# Altium project Controller-RK3562.PrjPcb (part 8 of 8)

## Sheet WF-BT-AP6256.SchDoc
size 420 x 289 mm; SheetNumber: 31; SheetTotal: 32
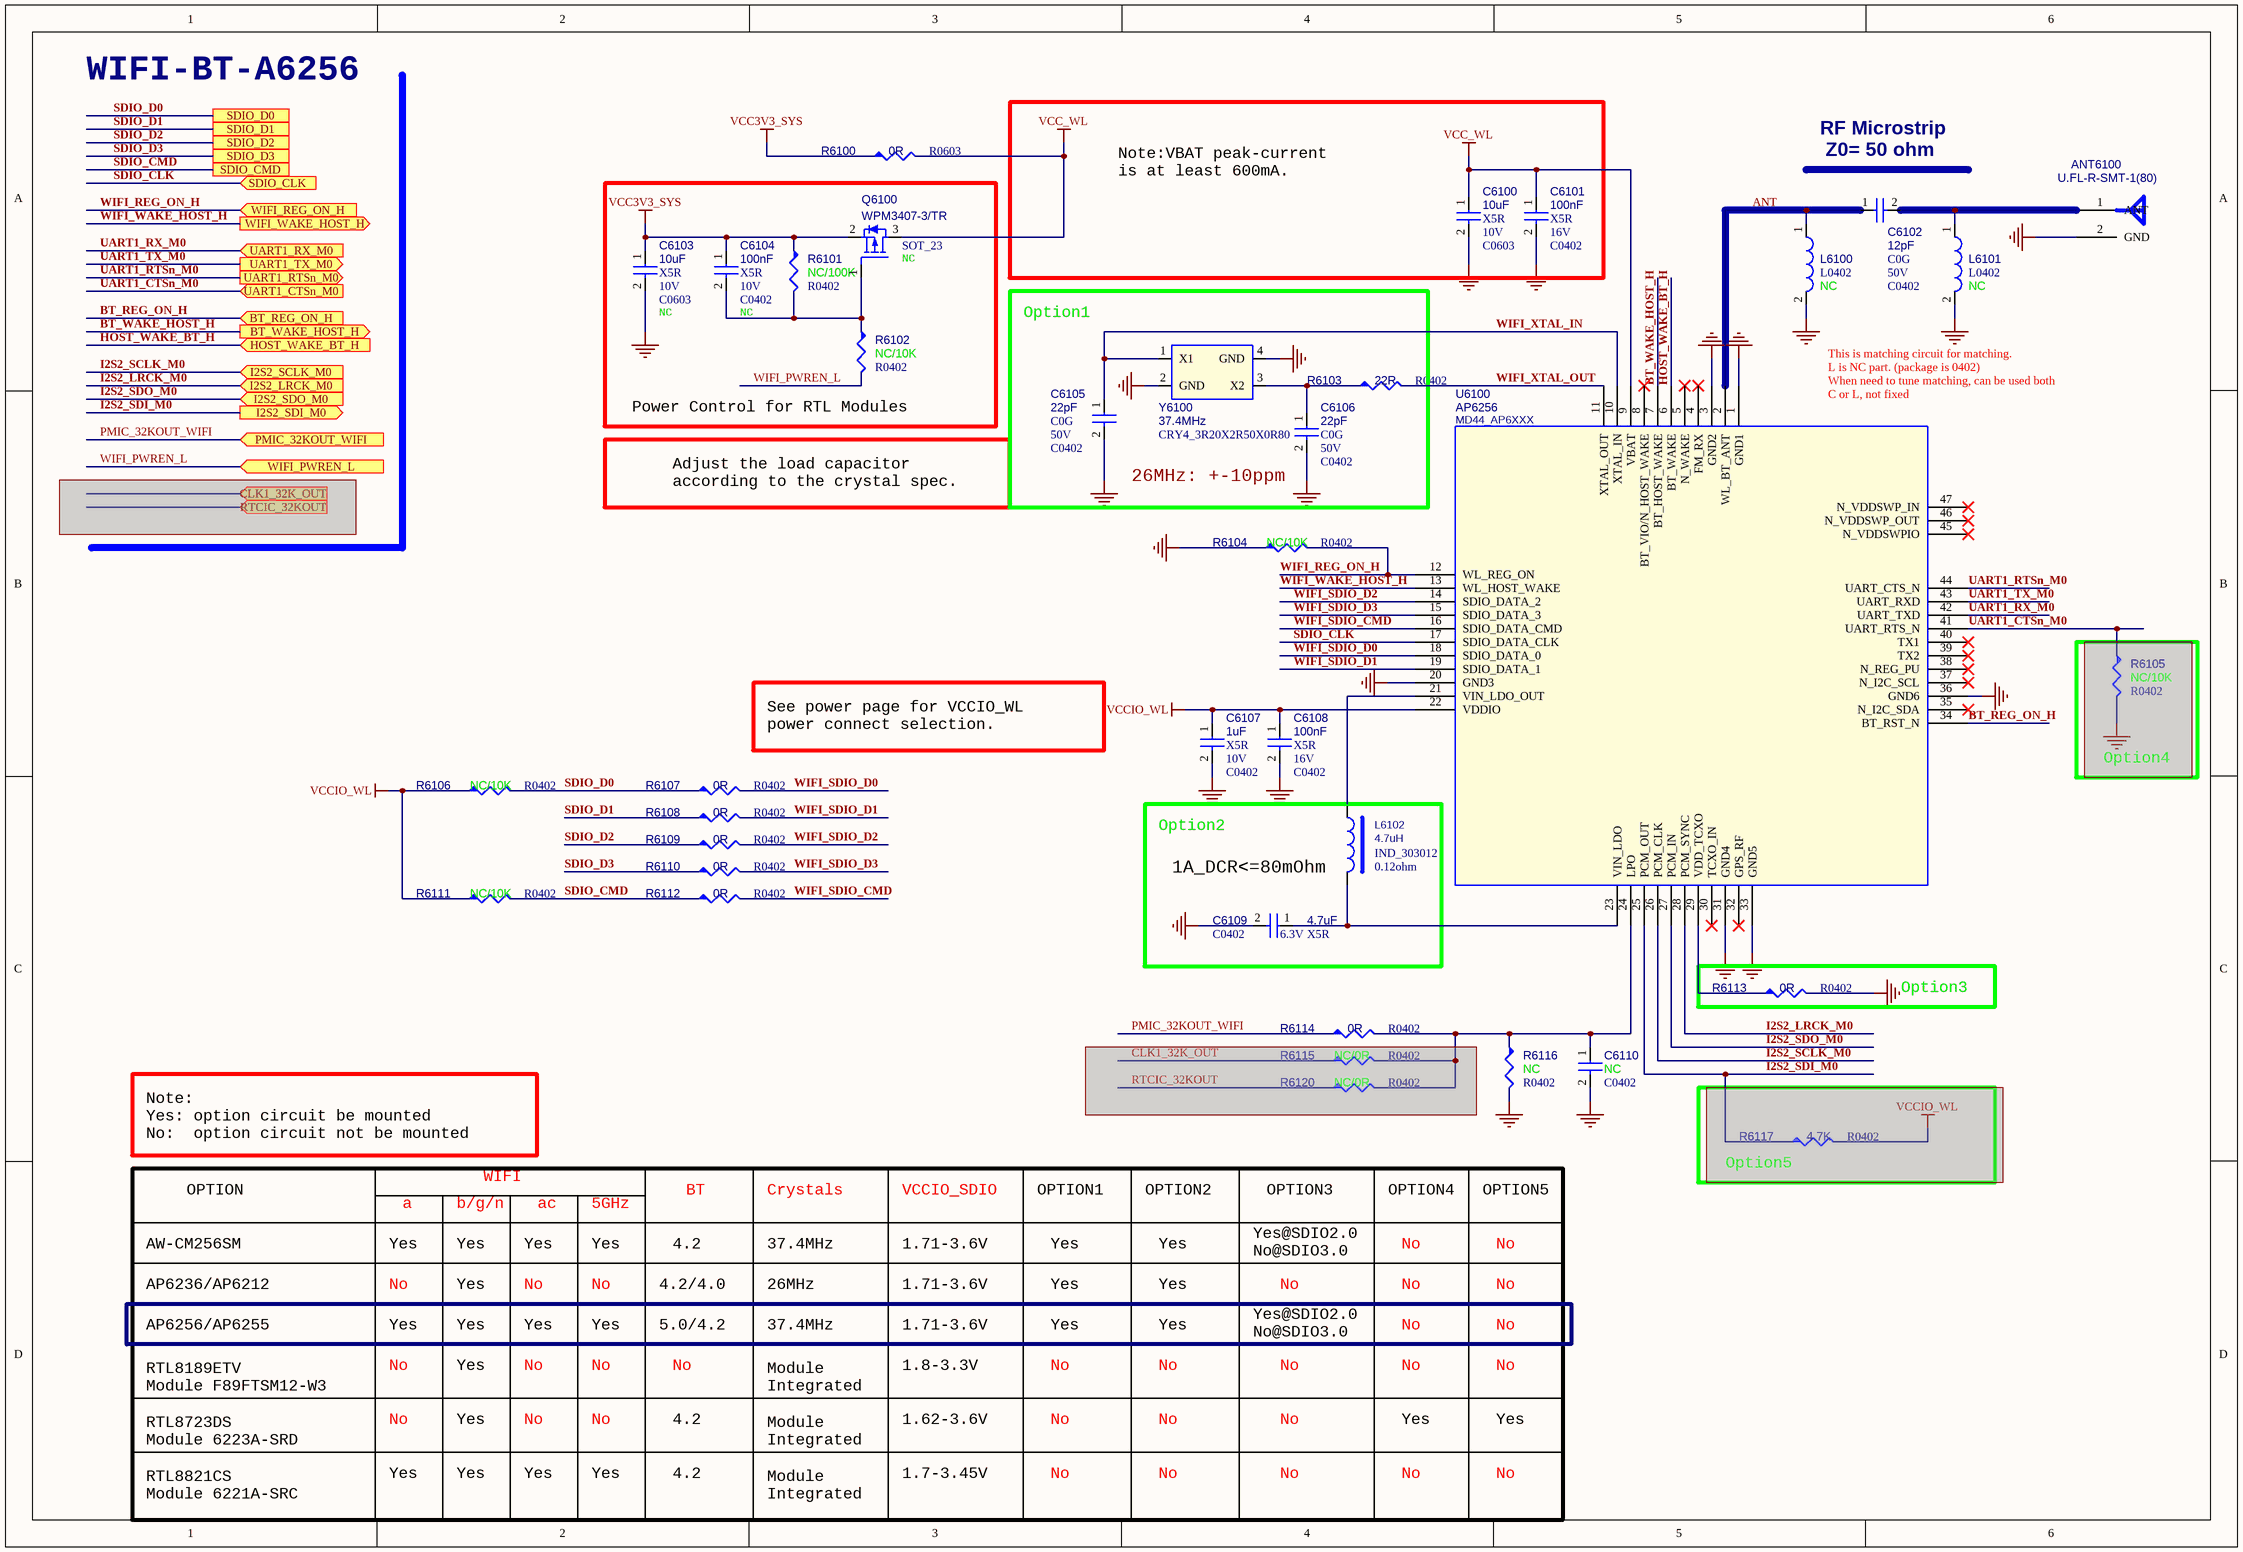
[diagram p36: WF-BT-AP6256.SchDoc]

### Parts
ANT6100  U.FL-R-SMT-1(80)  [IPEX-SMD_BWIPX-1-001E]
C6100  10uF  Dielectric: X5R  Voltage: 10V  [C0603]
C6101  100nF  Dielectric: X5R  Voltage: 16V  [C0402]
C6102  12pF  Dielectric: C0G  Voltage: 50V  [C0402]
C6103  10uF  Dielectric: X5R  Voltage: 10V  option: NC  [C0603]
C6104  100nF  Dielectric: X5R  Voltage: 10V  option: NC  [C0402]
C6105  22pF  Dielectric: C0G  Voltage: 50V  [C0402]
C6106  22pF  Dielectric: C0G  Voltage: 50V  [C0402]
C6107  1uF  Dielectric: X5R  Voltage: 10V  [C0402]
C6108  100nF  Dielectric: X5R  Voltage: 16V  [C0402]
C6109  4.7uF  Dielectric: X5R  Voltage: 6.3V  [C0402]
C6110  NC  [C0402]
L6100  NC  [L0402]
L6101  NC  [L0402]
L6102  4.7uH  PCB Footprint: IND_303012  DC Resistor: 0.12ohm  [IND_303015]
Q6100  WPM3407-3/TR  PCB Footprint: SOT_23  option: NC  [SOT23-3D]
R6100  0R  PCB Footprint: R0603  [R0402]
R6101  NC/100K  [R0402]
R6102  NC/10K  [R0402]
R6103  22R  [R0402]
R6104  NC/10K  [R0402]
R6105  NC/10K  [R0402]  (masked out: inside a compile mask, not in the netlist)
R6106  NC/10K  [R0402]
R6107  0R  [R0402]
R6108  0R  [R0402]
R6109  0R  [R0402]
R6110  0R  [R0402]
R6111  NC/10K  [R0402]
R6112  0R  [R0402]
R6113  0R  [R0402]
R6114  0R  [R0402]
R6115  NC/0R  [R0402]  (masked out: inside a compile mask, not in the netlist)
R6116  NC  [R0402]
R6117  4.7K  [R0402]  (masked out: inside a compile mask, not in the netlist)
R6120  NC/0R  [R0402]  (masked out: inside a compile mask, not in the netlist)
U6100  AP6256  PCB Footprint: MD44_AP6XXX  [QFN-44_L12.0-W12.0-P0.90-TL_AP6256]
Y6100  37.4MHz  [CRY4_3R20X2R50X0R80]

### Blocks framed on the sheet
Power Control for RTL Modules: C6103 C6104 Q6100 R6101 R6102
26MHz: +-10ppm: C6105 C6106 R6103 Y6100
Option4: R6105
1A_DCR<=80mOhm: C6109 L6102
Option3: R6113
Option5: R6117

### Ports
BT_REG_ON_H (in, see Controller-RK3562-TOP[7D], CONTROLLER-RK3562[7A], RK3562-PMUIO-OSC-PLL[5C]), BT_WAKE_HOST_H (out, see Controller-RK3562-TOP[7D], CONTROLLER-RK3562[7A], RK3562-PMUIO-OSC-PLL[5C]), CLK1_32K_OUT (in, see Controller-RK3562-TOP[7D], CONTROLLER-RK3562[7A]), HOST_WAKE_BT_H (in, see Controller-RK3562-TOP[7D], CONTROLLER-RK3562[7A], RK3562-PMUIO-OSC-PLL[5C]), I2S2_LRCK_M0 (in, see Controller-RK3562-TOP[7D], CONTROLLER-RK3562[3B], RK3562-VCCIO4[4B]), I2S2_SCLK_M0 (in, see Controller-RK3562-TOP[7D], CONTROLLER-RK3562[3B], RK3562-VCCIO4[4B]), I2S2_SDI_M0 (out, see Controller-RK3562-TOP[7D], CONTROLLER-RK3562[3B], RK3562-VCCIO4[4B]), I2S2_SDO_M0 (in, see Controller-RK3562-TOP[7D], CONTROLLER-RK3562[3B], RK3562-VCCIO4[4B]), PMIC_32KOUT_WIFI (in, see Controller-RK3562-TOP[7D], CONTROLLER-RK3562[1B], RK-POWER-SUPPLY[1A]), RTCIC_32KOUT (in, see Controller-RK3562-TOP[7D], CONTROLLER-RK3562[7A]), SDIO_CLK (in, see Controller-RK3562-TOP[7D], CONTROLLER-RK3562[3B], RK3562-VCCIO4[4A]), SDIO_CMD (see Controller-RK3562-TOP[7D], CONTROLLER-RK3562[3B], RK3562-VCCIO4[4A]), SDIO_D0 (see Controller-RK3562-TOP[7D], CONTROLLER-RK3562[3B], RK3562-VCCIO4[4A]), SDIO_D1 (see Controller-RK3562-TOP[7D], CONTROLLER-RK3562[3B], RK3562-VCCIO4[4A]), SDIO_D2 (see Controller-RK3562-TOP[7D], CONTROLLER-RK3562[3B], RK3562-VCCIO4[4A]), SDIO_D3 (see Controller-RK3562-TOP[7D], CONTROLLER-RK3562[3B], RK3562-VCCIO4[4A]), UART1_CTSn_M0 (in, see Controller-RK3562-TOP[7D], CONTROLLER-RK3562[3B], RK3562-VCCIO4[4B]), UART1_RTSn_M0 (out, see Controller-RK3562-TOP[7D], CONTROLLER-RK3562[3B], RK3562-VCCIO4[4B]), UART1_RX_M0 (in, see Controller-RK3562-TOP[7D], CONTROLLER-RK3562[3B]), UART1_TX_M0 (out, see Controller-RK3562-TOP[7D], CONTROLLER-RK3562[3B]), WIFI_PWREN_L (in, see Controller-RK3562-TOP[7D], CONTROLLER-RK3562[7A]), WIFI_REG_ON_H (in, see Controller-RK3562-TOP[7D], CONTROLLER-RK3562[7A], RK3562-PMUIO-OSC-PLL[5C]), WIFI_WAKE_HOST_H (out, see Controller-RK3562-TOP[7D], CONTROLLER-RK3562[7A], RK3562-PMUIO-OSC-PLL[5C])

### Nets
GND: ANT6100.2(GND) C6100.2 C6101.2 C6103.2 C6105.2 C6106.2 C6107.2 C6108.2 C6109.2 C6110.2 L6100.2 L6101.2 R6104.1 R6113.2 R6116.2 U6100.1(GND1) U6100.3(GND2) U6100.20(GND3) U6100.31(GND4) U6100.33(GND5) U6100.36(GND6) Y6100.2(GND) Y6100.4(GND)
VCC3V3_SYS: C6103.1 C6104.1 Q6100.2(SOURCE) R6100.1 R6101.1
VCC_WL: C6100.1 C6101.1 Q6100.3(DRAIN) R6100.2 U6100.9(VBAT)
VCCIO_WL: C6107.1 C6108.1 R6106.1 R6111.1 U6100.22(VDDIO)
ANT: C6102.1 L6100.1 U6100.2(WL_BT_ANT)
BT_REG_ON_H: U6100.34(BT_RST_N) ; port BT_REG_ON_H
BT_WAKE_HOST_H: U6100.7(BT_HOST_WAKE) ; port BT_WAKE_HOST_H
HOST_WAKE_BT_H: U6100.6(BT_WAKE) ; port HOST_WAKE_BT_H
I2S2_LRCK_M0: U6100.28(PCM_SYNC) ; port I2S2_LRCK_M0
I2S2_SCLK_M0: U6100.26(PCM_CLK) ; port I2S2_SCLK_M0
I2S2_SDI_M0: U6100.25(PCM_OUT) ; port I2S2_SDI_M0
I2S2_SDO_M0: U6100.27(PCM_IN) ; port I2S2_SDO_M0
PMIC_32KOUT_WIFI: R6114.1 ; port PMIC_32KOUT_WIFI
SDIO_CLK: U6100.17(SDIO_DATA_CLK) ; port SDIO_CLK
SDIO_CMD: R6111.2 R6112.1 ; port SDIO_CMD
SDIO_D0: R6106.2 R6107.1 ; port SDIO_D0
SDIO_D1: R6108.1 ; port SDIO_D1
SDIO_D2: R6109.1 ; port SDIO_D2
SDIO_D3: R6110.1 ; port SDIO_D3
UART1_CTSn_M0: U6100.41(UART_RTS_N) ; port UART1_CTSn_M0
UART1_RTSn_M0: U6100.44(UART_CTS_N) ; port UART1_RTSn_M0
UART1_RX_M0: U6100.42(UART_TXD) ; port UART1_RX_M0
UART1_TX_M0: U6100.43(UART_RXD) ; port UART1_TX_M0
WIFI_PWREN_L: R6102.2 ; port WIFI_PWREN_L
WIFI_REG_ON_H: R6104.2 U6100.12(WL_REG_ON) ; port WIFI_REG_ON_H
WIFI_SDIO_CMD: R6112.2 U6100.16(SDIO_DATA_CMD)
WIFI_SDIO_D0: R6107.2 U6100.18(SDIO_DATA_0)
WIFI_SDIO_D1: R6108.2 U6100.19(SDIO_DATA_1)
WIFI_SDIO_D2: R6109.2 U6100.14(SDIO_DATA_2)
WIFI_SDIO_D3: R6110.2 U6100.15(SDIO_DATA_3)
WIFI_WAKE_HOST_H: U6100.13(WL_HOST_WAKE) ; port WIFI_WAKE_HOST_H
WIFI_XTAL_IN: C6105.1 U6100.10(XTAL_IN) Y6100.1(X1)
WIFI_XTAL_OUT: R6103.2 U6100.11(XTAL_OUT)
NetANT6100_1: ANT6100.1(ANT) C6102.2 L6101.1
NetC6104_2: C6104.2 Q6100.1(GATE) R6101.2 R6102.1
NetC6106_1: C6106.1 R6103.1 Y6100.3(X2)
NetC6109_1: C6109.1 L6102.2 U6100.23(VIN_LDO)
NetC6110_1: C6110.1 R6114.2 R6116.1 U6100.24(LPO)
NetL6102_1: L6102.1 U6100.21(VIN_LDO_OUT)
NetR6113_1: R6113.1 U6100.29(VDD_TCXO)

Not connected (* = marked no-connect by the designer): U6100 4(FM_RX)* 5(N_WAKE)* 8(BT_VIO/N_HOST_WAKE)* 30(TCXO_IN)* 32(GPS_RF)* 35(N_I2C_SDA)* 37(N_I2C_SCL)* 38(N_REG_PU)* 39(TX2)* 40(TX1)* 45(N_VDDSWPIO)* 46(N_VDDSWP_OUT)* 47(N_VDDSWP_IN)*

### Notes on the sheet
- WIFI-BT-A6256
- RF Microstrip
  Z0= 50 ohm
- Note:VBAT peak-current
  is at least 600mA.
- Option1
- (near U6100) This is matching circuit for matching.
  L is NC part. (package is 0402)
  When need to tune matching, can be used both C or L, not fixed
- Adjust the load capacitor
  according to the crystal spec.
- See power page for VCCIO_WL
  power connect selection.
- Option2
- Note:
  Yes: option circuit be mounted
  No:  option circuit not be mounted
- OPTION
- a
- b/g/n
- WIFI
- ac
- 5GHz
- BT
- Crystals
- VCCIO_SDIO
- OPTION1
- OPTION2
- OPTION3
- OPTION4
- OPTION5
- AW-CM256SM
- AP6236/AP6212
- Yes
- No
- 4.2/4.0
- 4.2
- 37.4MHz
- 26MHz
- 1.71-3.6V
- Yes@SDIO2.0
  No@SDIO3.0
- AP6256/AP6255
- 5.0/4.2
- 1.8-3.3V
- RTL8189ETV
  Module F89FTSM12-W3
- Module
  Integrated
- 1.62-3.6V
- RTL8723DS
  Module 6223A-SRD
- RTL8821CS
  Module 6221A-SRC
- 1.7-3.45V

### Library data of the parts
ANT6100 = ANT_1P1G: BWIPX-1-001E; Manufacturer: Rockchip
C6100 = CAP NP: cap,10.00uF,+/-10%,10V,X5R,C0603; Part Reference: C6100; Manufacturer PN: C1608X5R1A106K080AC; Manufacturer: TDK; Tolerance: 10%; Priority: A; PCB Footprint: C0603; Value: 10uF; Created by: JJJ; Part Type: C0603; RK PN: C1608X5R1A106K080AC
C6101 = CAP NP: cap,100.00nF,+/-10%,16V,X5R,C0402; Part Reference: C6101; Manufacturer PN: C1005X5R1C104K050BA; Manufacturer: TDK; C_Voltage: 10V; Tolerance: 10%; Priority: A; Number: 37; PCB Footprint: C0402; Value: 100nF; Created by: JJJ; Part Type: C0402; RK PN: C1005X5R1C104K050BA
C6102 = CAP NP: cap,10.00pF,+/-0.5,50V,C0G,C0402; Part Reference: C6102; Manufacturer: TDK; Priority: A; Tolerance: +/-0.5pF; PCB Footprint: C0402; Value: 12pF; Part Type: C0402; Created by: JJJ
C6103 = CAP NP: cap,10.00uF,+/-10%,10V,X5R,C0603; Part Reference: C6103; Manufacturer PN: C1608X5R1A106K080AC; Manufacturer: TDK; Tolerance: 10%; C_Voltage: 6.3V; Priority: A; PCB Footprint: C0603; Value: 10uF; Created by: JJJ; Part Type: C0603; RK PN: C1608X5R1A106K080AC
C6104 = CAP NP: cap,100.00nF,+/-10%,10V,X5R,C0402; Part Reference: C6104; Manufacturer: TDK; Number: 37; RK PN: C1005X5R1A104K050BA; Priority: A; Tolerance: 10%; C_Voltage: 6.3V; PCB Footprint: C0402; Value: 100nF; Part Type: C0402; Manufacturer PN: C1005X5R1A104K050BA; Created by: JJJ
C6105 = CAP NP: cap,22.00pF,+/-5%,50V,C0G,C0402; Part Reference: C6105; Manufacturer: TDK; RK PN: C1005C0G1H220J050BA; Priority: A; Tolerance: 5%; PCB Footprint: C0402; Value: 22pF; Part Type: C0402; Manufacturer PN: C1005C0G1H220J050BA; Created by: JJJ
C6106 = CAP NP: cap,22.00pF,+/-5%,50V,C0G,C0402; Part Reference: C6106; Manufacturer: TDK; RK PN: C1005C0G1H220J050BA; Priority: A; Tolerance: 5%; PCB Footprint: C0402; Value: 22pF; Part Type: C0402; Manufacturer PN: C1005C0G1H220J050BA; Created by: JJJ
C6107 = CAP NP: cap,1.00uF,+/-10%,10V,X5R,C0402; Part Reference: C6107; Manufacturer PN: C1005X5R1A105K050BB; Manufacturer: TDK; Tolerance: 10%; Priority: A; PCB Footprint: C0402; Value: 1uF; Created by: JJJ; Part Type: C0402; RK PN: C1005X5R1A105K050BB
C6108 = CAP NP: cap,100.00nF,+/-10%,16V,X5R,C0402; Part Reference: C6108; Manufacturer: TDK; Number: 37; RK PN: C1005X5R1C104K050BA; Priority: A; Tolerance: 10%; C_Voltage: 10V; PCB Footprint: C0402; Value: 100nF; Part Type: C0402; Manufacturer PN: C1005X5R1C104K050BA; Created by: JJJ
C6109 = CAP NP: cap,4.70uF,+/-10%,6.3V,X5R,C0402; Part Reference: C6109; Manufacturer: TDK; RK PN: C1005X5R0J475K050BC; Priority: A; Tolerance: 10%; PCB Footprint: C0402; Value: 4.7uF; Part Type: C0402; Manufacturer PN: C1005X5R0J475K050BC; Created by: JJJ
C6110 = CAP NP_NC: NC电容，无容值.; Part Reference: C6110; Optional: X; Priority: A; RK PN: 902012106-1; PCB Footprint: C0402; Value: NC; Created by: JJJ; Part Type: NC电容
L6100 = INDUCTOR: Did Not Place.; Part Reference: L6100; RK PN: DNPL0402; Priority: A; PCB Footprint: L0402; Value: NC; Part Type: IND; Created by: JJJ
L6101 = INDUCTOR: Did Not Place.; Part Reference: L6101; Priority: A; RK PN: DNPL0402; PCB Footprint: L0402; Value: NC; Created by: JJJ; Part Type: IND
L6102 = INDUCTORS OF FERRITE: Power Inductor,4.7uH,0.2,IND_303012; Part Reference: L6102; Manufacturer: sunlord; Isat: 0.90A; RK PN: SWPA3012S4R7MT; Priority: A; Tolerance: 20%; Irms: 1.24A; Resonace frequency: 61M; Value: 4.7uH; Part Type: POWER_IND; Manufacturer PN: SWPA3012S4R7MT; Created by: YTL
Q6100 = MOSFET P_Dup1: PMOS,WPM3407-3/TR,SOT_23,Id=4.4A,Vds=30V; Part Reference: Q6100; Manufacturer: WillSemi(韦尔半导体); Pd: 0.9W; Vgsth: 2.0V; VDS: 30V; Vgs: ±20V; Id_max: 4.4A; Priority: A; Value: WPM3407-3/TR; Created by: JJJ; Manufacturer PN: WPM3407-3/TR; Part Type: PMOS; RK PN: WPM3407-3/TR
R6100 = RESISTOR5: 通用厚膜电阻,0R,+/-5%,R0603,1/10W.; Part Reference: R6100; Manufacturer: YAGEO; Manufacturer PN: RC0603JR-070RL; Tolerance: 5%; RK PN: 901002435; Priority: A; Wattage: 1/10W; Value: 0R; Part Type: 通用厚膜电阻; Created by: YTL
R6101 = RESISTOR5_NC: 通用厚膜电阻,100K,+/-5%,R0402,1/16W.; Part Reference: R6101; Manufacturer: YAGEO; Manufacturer PN: RC0402JR-07100KL; Tolerance: 5%; RK PN: 901001447-1; Priority: A; Wattage: 1/16W; Optional: X; PCB Footprint: R0402; Value: NC/100K; Part Type: 通用厚膜电阻; Created by: YTL
R6102 = RESISTOR5_NC: 通用厚膜电阻,10K,+/-5%,R0402,1/16W.; Part Reference: R6102; Manufacturer PN: RC0402JR-0710KL; Manufacturer: YAGEO; Tolerance: 5%; Optional: X; Wattage: 1/16W; Priority: A; RK PN: 901001449-1; PCB Footprint: R0402; Value: NC/10K; Created by: YTL; Part Type: 通用厚膜电阻
R6103 = RESISTOR5: 通用厚膜电阻,22R,+/-5%,R0402,1/16W.; Part Reference: R6103; Manufacturer: YAGEO; Manufacturer PN: RC0402JR-0722RL; Tolerance: 5%; RK PN: 901001505; Priority: A; Wattage: 1/16W; PCB Footprint: R0402; Value: 22R; Part Type: 通用厚膜电阻; Created by: YTL
R6104 = RESISTOR5_NC: 通用厚膜电阻,10K,+/-5%,R0402,1/16W.; Part Reference: R6104; Manufacturer: YAGEO; Manufacturer PN: RC0402JR-0710KL; Tolerance: 5%; RK PN: 901001449-1; Priority: A; Wattage: 1/16W; Optional: X; PCB Footprint: R0402; Value: NC/10K; Part Type: 通用厚膜电阻; Created by: YTL
R6105 = RESISTOR5_NC: 通用厚膜电阻,10K,+/-5%,R0402,1/16W.; Part Reference: R6105; Manufacturer PN: RC0402JR-0710KL; Manufacturer: YAGEO; Tolerance: 5%; Optional: X; Wattage: 1/16W; Priority: A; RK PN: 901001449-1; PCB Footprint: R0402; Value: NC/10K; Created by: YTL; Part Type: 通用厚膜电阻
R6106 = RESISTOR5_NC: 通用厚膜电阻,10K,+/-5%,R0402,1/16W.; Part Reference: R6106; Manufacturer: YAGEO; Manufacturer PN: RC0402JR-0710KL; Tolerance: 5%; RK PN: 901001449-1; Priority: A; Wattage: 1/16W; Optional: X; PCB Footprint: R0402; Value: NC/10K; Part Type: 通用厚膜电阻; Created by: YTL
R6107 = RESISTOR5: 通用厚膜电阻,0R,+/-5%,R0402,1/16W.; Part Reference: R6107; Manufacturer: YAGEO; Manufacturer PN: RC0402JR-070RL; Tolerance: 5%; RK PN: 901001446; Priority: A; Wattage: 1/16W; PCB Footprint: R0402; Value: 0R; Part Type: 通用厚膜电阻; Created by: YTL
R6108 = RESISTOR5: 通用厚膜电阻,0R,+/-5%,R0402,1/16W.; Part Reference: R6108; Manufacturer: YAGEO; Manufacturer PN: RC0402JR-070RL; Tolerance: 5%; RK PN: 901001446; Priority: A; Wattage: 1/16W; PCB Footprint: R0402; Value: 0R; Part Type: 通用厚膜电阻; Created by: YTL
R6109 = RESISTOR5: 通用厚膜电阻,0R,+/-5%,R0402,1/16W.; Part Reference: R6109; Manufacturer: YAGEO; Manufacturer PN: RC0402JR-070RL; Tolerance: 5%; RK PN: 901001446; Priority: A; Wattage: 1/16W; PCB Footprint: R0402; Value: 0R; Part Type: 通用厚膜电阻; Created by: YTL
R6110 = RESISTOR5: 通用厚膜电阻,0R,+/-5%,R0402,1/16W.; Part Reference: R6110; Manufacturer: YAGEO; Manufacturer PN: RC0402JR-070RL; Tolerance: 5%; RK PN: 901001446; Priority: A; Wattage: 1/16W; PCB Footprint: R0402; Value: 0R; Part Type: 通用厚膜电阻; Created by: YTL
R6111 = RESISTOR5_NC: 通用厚膜电阻,10K,+/-5%,R0402,1/16W.; Part Reference: R6111; Manufacturer: YAGEO; Manufacturer PN: RC0402JR-0710KL; Tolerance: 5%; RK PN: 901001449-1; Priority: A; Wattage: 1/16W; Optional: X; PCB Footprint: R0402; Value: NC/10K; Part Type: 通用厚膜电阻; Created by: YTL
R6112 = RESISTOR5: 通用厚膜电阻,0R,+/-5%,R0402,1/16W.; Part Reference: R6112; Manufacturer: YAGEO; Manufacturer PN: RC0402JR-070RL; Tolerance: 5%; RK PN: 901001446; Priority: A; Wattage: 1/16W; PCB Footprint: R0402; Value: 0R; Part Type: 通用厚膜电阻; Created by: YTL
R6113 = RESISTOR5: 通用厚膜电阻,0R,+/-5%,R0402,1/16W.; Part Reference: R6113; Manufacturer PN: RC0402JR-070RL; Manufacturer: YAGEO; Tolerance: 5%; Wattage: 1/16W; Priority: A; RK PN: 901001446; PCB Footprint: R0402; Value: 0R; Created by: YTL; Part Type: 通用厚膜电阻
R6114 = RESISTOR5: 通用厚膜电阻,0R,+/-5%,R0402,1/16W.; Part Reference: R6114; Manufacturer PN: RC0402JR-070RL; Manufacturer: YAGEO; Tolerance: 5%; Wattage: 1/16W; Priority: A; RK PN: 901001446; PCB Footprint: R0402; Value: 0R; Created by: YTL; Part Type: 通用厚膜电阻
R6115 = RESISTOR5_NC: 通用厚膜电阻,0R,+/-5%,R0402,1/16W.; Part Reference: R6115; Manufacturer PN: RC0402JR-070RL; Manufacturer: YAGEO; Tolerance: 5%; Optional: X; Wattage: 1/16W; Priority: A; RK PN: 901001446-1; PCB Footprint: R0402; Value: NC/0R; Created by: YTL; Part Type: 通用厚膜电阻
R6116 = RESISTOR5_NC: NC电阻，无阻值.; Part Reference: R6116; Optional: X; Priority: A; RK PN: 901006427-1; PCB Footprint: R0402; Value: NC; Created by: JJJ; Part Type: NC电阻
R6117 = RESISTOR5: 通用厚膜电阻,4K7,+/-5%,R0402,1/16W.; Part Reference: R6117; Manufacturer: YAGEO; Manufacturer PN: RC0402JR-074K7L; Tolerance: 5%; RK PN: 901001562; Priority: A; Wattage: 1/16W; PCB Footprint: R0402; Value: 4.7K; Part Type: 通用厚膜电阻; Created by: YTL
R6120 = RESISTOR5_NC: 通用厚膜电阻,0R,+/-5%,R0402,1/16W.; Part Reference: R6120; Manufacturer: YAGEO; Manufacturer PN: RC0402JR-070RL; Tolerance: 5%; RK PN: 901001446-1; Priority: A; Wattage: 1/16W; Optional: X; PCB Footprint: R0402; Value: NC/0R; Part Type: 通用厚膜电阻; Created by: YTL
U6100 = MODULE_AP6XXX: WiFi 802.11b/g/n + BT4.0; Part Reference: U6100; Manufacturer PN: RL-SM02BD; Manufacturer: RF-LINK(博鹏发); Priority: A; Value: AP6256; Created by: JJJ; Part Type: module; RK PN: RL-SM02BD
Y6100 = CRYSTAL_4P: 无源晶振，26M，3225,±10ppm，8pF，Hosonic; Part Reference: Y6100; Manufacturer: Hosonic(鸿星电子); Manufacturer PN: HCX-3SB26.0000; Value: 26MHz; RK PN: 26MHz_Hosonic; Priority: A; PCB Footprint: CRY4_3R20X2R50X0R80; Part Type: CRYSTAL; Created by: JJJ

## Sheet IMU-ICM-4267-P .SchDoc
size A4; SheetNumber: 32; SheetTotal: 32
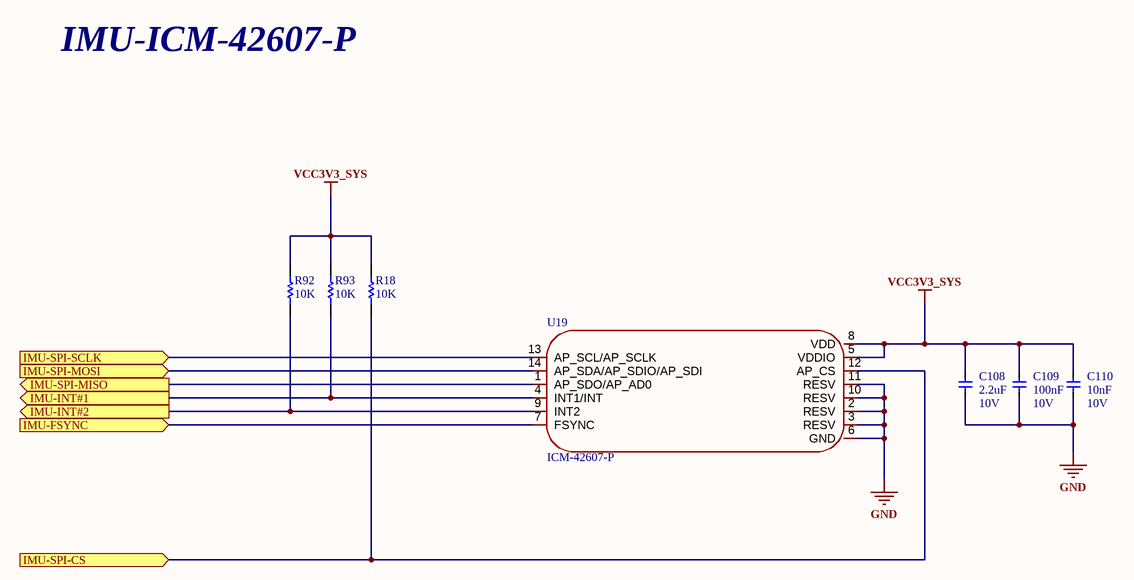
[diagram p37: IMU-ICM-4267-P .SchDoc]

### Parts
C108  2.2uF  VoltageRate: 10V  [CAP-0603]
C109  100nF  VoltageRate: 10V  [CAP-0402]
C110  10nF  VoltageRate: 10V  [CAP-0402]
R18  10K  [RES-0402]
R92  10K  [RES-0402]
R93  10K  [RES-0402]
U19  ICM-42607-P  [LGA-14_L3.0-W2.5-P0.50-TL_QMI8658A]

### Ports
IMU-FSYNC (in, see Controller-RK3562-TOP[2D], STM32G070RBT6[4C]), IMU-INT#1 (out, see Controller-RK3562-TOP[2C], STM32G070RBT6[4C]), IMU-INT#2 (out, see Controller-RK3562-TOP[2C], STM32G070RBT6[4B]), IMU-SPI-CS (in, see Controller-RK3562-TOP[2C], STM32G070RBT6[2C]), IMU-SPI-MISO (out, see Controller-RK3562-TOP[2C], STM32G070RBT6[2C]), IMU-SPI-MOSI (in, see Controller-RK3562-TOP[2C], STM32G070RBT6[2C]), IMU-SPI-SCLK (in, see Controller-RK3562-TOP[2C], STM32G070RBT6[2C])

### Nets
GND: C108.1 C109.1 C110.1 U19.2(RESV) U19.3(RESV) U19.6(GND) U19.10(RESV) U19.11(RESV)
VCC3V3_SYS: C108.2 C109.2 C110.2 R18.1 R92.1 R93.1 U19.5(VDDIO) U19.8(VDD)
IMU-CS: R18.2 U19.12(AP_CS) ; port IMU-SPI-CS
IMU-FSYNC: U19.7(FSYNC) ; port IMU-FSYNC
IMU-INT1: R93.2 U19.4(INT1/INT) ; port IMU-INT#1
IMU-INT2: R92.2 U19.9(INT2) ; port IMU-INT#2
IMU-MISO: U19.1(AP_SDO/AP_AD0) ; port IMU-SPI-MISO
IMU-MOSI: U19.14(AP_SDA/AP_SDIO/AP_SDI) ; port IMU-SPI-MOSI
IMU-SCLK: U19.13(AP_SCL/AP_SCLK) ; port IMU-SPI-SCLK

### Notes on the sheet
- IMU-ICM-42607-P

### Library data of the parts
C108-C110 = Capacitor-1: ManufacturingPartNumber: *; Manufacturer: *; SupplierPartNumber: *; Supplier: *
R18 R92 R93 = Resistor-1: ManufacturingPartNumber: *; Manufacturer: *; SupplierPartNumber: *; Supplier: *; VoltageRate: *
U19 = ICM-42607-P: ManufacturingPartNumber: *; Manufacturer: *; SupplierPartNumber: *; Supplier: *; VoltageRate: *

## Nets that join several sheets
BAT-VCC: BMS-SYSTEM-POWER (6 pins), MAIN-BRUSH-MOTOR  (D7.2 J11.1), WHEEL-MOTORs  (6 pins), MAIN-FAN  (Q14.2 R103.1), SIDE-BRUSH-MOTORs  (D8.2 D9.2 J15.1 J16.1)
GND: CONTROLLER-RK3562 (J3.1 J3.4 J3.5), eMMC (23 pins), RK3562-POWER-GND (191 pins), RK3562-DDR-PHY (10 pins), RK3562-PMUIO-OSC-PLL (14 pins), RK3562-VCCIO1 (C1300.2), RK3562-VCCIO2-VCCIO3 (C1400.2 C1401.2 TP1401.1), RK3562-VCCIO4 (9 pins), RK3562-VCCIO5 (5 pins), RK3562-VCCIO6 (C1700.2 C1701.2 C1702.2), RK3562-USB-PCIe-PHY (6 pins), DDR-LPDDR4 (116 pins), SD_TF-CARD (14 pins), RK-POWER-SUPPLY (60 pins), RK-PERIPHERAL-POWER (34 pins), BMS-SYSTEM-POWER (48 pins), DOCKING IR-BUMPER-SENSOR (6 pins), ANTI-FALL-IR-SENSORs (10 pins), SIDE-PROXIMITY-IR-SENSOR  (6 pins), WATER-PUMP  (7 pins), MAIN-BRUSH-MOTOR  (5 pins), WHEEL-MOTORs  (23 pins), MAIN-FAN  (6 pins), SIDE-BRUSH-MOTORs  (10 pins), LiDAR  (6 pins), SPEAKER-MIC (8 pins), BUTTON-LEDs  (6 pins), MIPI-CAMERA (24 pins), STM32G070RBT6 (14 pins), WF-BT-AP6256 (23 pins), IMU-ICM-4267-P  (8 pins)
PMUIO1: RK3562-PMUIO-OSC-PLL (C1213.1 R41.1 R1239.1 U1000.1L11), RK-PERIPHERAL-POWER (R2209.1 R2214.1)
USB_AVDD_0V9: RK3562-USB-PCIe-PHY (C1803.1 C1805.1 U1000.1K14 U1000.1L14), RK-PERIPHERAL-POWER (C2200.1 FB2200.2)
USB_AVDD_1V8: RK3562-USB-PCIe-PHY (C1802.1 C1804.1 U1000.1K15 U1000.1M15), RK-PERIPHERAL-POWER (C2201.1 FB2201.2)
VCC0V6_DDR: RK3562-DDR-PHY (9 pins), DDR-LPDDR4 (46 pins)
VCC1V8_DVP0: RK-PERIPHERAL-POWER (C2226.1 R2233.2), MIPI-CAMERA (C4500.1 J4500.24 R4500.1)
VCC2V8_AF0: RK-PERIPHERAL-POWER (FB2204.2), MIPI-CAMERA (C4505.1 C4506.1 J4500.18)
VCC2V8_DVP0: RK-PERIPHERAL-POWER (C2239.1 FB2204.1 R2243.2), MIPI-CAMERA (C4503.1 C4504.1 J4500.17)
VCC3V3_PMU: RK3562-PMUIO-OSC-PLL (R41.2 R1235.2), RK-POWER-SUPPLY (C2116.1 R2112.1 U2100.31)
VCC3V3_SD: SD_TF-CARD (C4200.1 C4201.1 J4200.4), RK-POWER-SUPPLY (C2124.1 U2100.58)
VCC3V3_SYS: DDR-LPDDR4 (C3060.1 U3002.4), RK-POWER-SUPPLY (19 pins), RK-PERIPHERAL-POWER (6 pins), BMS-SYSTEM-POWER (6 pins), WF-BT-AP6256 (5 pins), IMU-ICM-4267-P  (8 pins)
VCC-3V3-P: BMS-SYSTEM-POWER (8 pins), DOCKING IR-BUMPER-SENSOR (8 pins), ANTI-FALL-IR-SENSORs (8 pins), SIDE-PROXIMITY-IR-SENSOR  (J8.2 J9.2 R75.2 R78.2), WHEEL-MOTORs  (R94.1 R101.1 U14.4 U15.4), BUTTON-LEDs  (5 pins), STM32G070RBT6 (8 pins)
VCC-5V-RK: RK-POWER-SUPPLY (FB2100.1), BMS-SYSTEM-POWER (C15.2 Q5.3)
VCC-5V-SYS: RK-POWER-SUPPLY (R2109.1), RK-PERIPHERAL-POWER (C2202.1 U2200.4), BMS-SYSTEM-POWER (12 pins), SIDE-PROXIMITY-IR-SENSOR  (J8.3 J9.3 R76.1 R79.1), WATER-PUMP  (Q8.2 R25.2), WHEEL-MOTORs  (Q12.2 R88.2), LiDAR  (D10.2 J17.1 J17.4)
VCC_1V8: RK3562-PMUIO-OSC-PLL (R1242.1), RK3562-VCCIO4 (R1535.1 R1536.1), RK3562-VCCIO5 (R1604.2), RK-POWER-SUPPLY (5 pins), RK-PERIPHERAL-POWER (5 pins)
VCC_3V3: eMMC (7 pins), RK3562-VCCIO6 (R1702.2), RK3562-USB-PCIe-PHY (R1802.2), RK-POWER-SUPPLY (C2132.1 U2100.55), RK-PERIPHERAL-POWER (R2202.1)
VCC_DDR: RK3562-DDR-PHY (12 pins), DDR-LPDDR4 (49 pins), RK-POWER-SUPPLY (5 pins)
VCC_MIC: RK-PERIPHERAL-POWER (C2214.1 R2216.2), SPEAKER-MIC (R19.1)
VCC_RSV1: RK-POWER-SUPPLY (C2101.1 U2100.23), RK-PERIPHERAL-POWER (R2216.1)
VCCA1V8_IMAGE: RK3562-VCCIO5 (C1600.1 C1602.1 U1000.1M7 U1000.1M8), RK3562-VCCIO6 (C1700.1 U1000.1N9), RK-PERIPHERAL-POWER (C2210.1 FB2203.2)
VCCA1V8_PMU: RK3562-PMUIO-OSC-PLL (R1237.1 R1239.2), DDR-LPDDR4 (C3055.1 R3015.1), RK-POWER-SUPPLY (C2121.1 U2100.5), RK-PERIPHERAL-POWER (R2201.1)
VCCIO_ACODEC: RK3562-VCCIO1 (C1300.1 U1000.1L3), RK-POWER-SUPPLY (C2105.1 U2100.28)
VCCIO_FLASH: eMMC (13 pins), RK3562-VCCIO2-VCCIO3 (C1400.1 U1000.1F14), RK-PERIPHERAL-POWER (C2203.1 R2202.2 R2205.2)
VCCIO_SD: RK3562-VCCIO2-VCCIO3 (C1401.1 R1447.1 R1448.1 U1000.1G15), RK-POWER-SUPPLY (C2109.1 U2100.29)
VCCIO_WL: RK3562-VCCIO4 (C1500.1 U1000.1H14), RK-POWER-SUPPLY (R2110.1), RK-PERIPHERAL-POWER (C2207.1 R2201.2), WF-BT-AP6256 (5 pins)
VDD1V2_DVP0: RK-PERIPHERAL-POWER (C2219.1 R2222.2), MIPI-CAMERA (C4501.1 C4502.1 J4500.22)
VDD_CPU: RK3562-POWER-GND (12 pins), RK-POWER-SUPPLY (9 pins)
VDD_GPU: RK3562-POWER-GND (12 pins), RK-POWER-SUPPLY (9 pins)
VDD_LOGIC: RK3562-POWER-GND (15 pins), RK-POWER-SUPPLY (9 pins)
VDD_NPU: RK3562-POWER-GND (11 pins), RK-PERIPHERAL-POWER (5 pins)
VDDA0V9_IMAGE: RK3562-VCCIO5 (C1601.1 C1603.1 U1000.1L6 U1000.1L8), RK3562-VCCIO6 (C1701.1 U1000.1M9), RK-PERIPHERAL-POWER (C2209.1 FB2202.2)
VDDA0V9_PMU: RK3562-PMUIO-OSC-PLL (R1236.1 R1243.2), RK-POWER-SUPPLY (C2104.1 U2100.20)
VDDA_0V9: RK3562-PMUIO-OSC-PLL (R1238.1), RK-POWER-SUPPLY (C2103.1 U2100.21), RK-PERIPHERAL-POWER (FB2200.1 FB2202.1)
BT_REG_ON_H: RK3562-PMUIO-OSC-PLL (U1000.AE18), WF-BT-AP6256 (U6100.34)
BT_WAKE_HOST_H: RK3562-PMUIO-OSC-PLL (U1000.AF19), WF-BT-AP6256 (U6100.7)
CAM_CLK0_OUT: RK3562-VCCIO5 (U1000.H3), MIPI-CAMERA (C4508.1 J4500.11)
CAM_PDN0_L: RK3562-VCCIO5 (U1000.H2), MIPI-CAMERA (J4500.14)
CAM_PWREN_H: RK3562-VCCIO5 (U1000.G1), RK-PERIPHERAL-POWER (R2228.1 R2235.1 R2245.1)
CAM_RST0_L: RK3562-VCCIO5 (U1000.D1), MIPI-CAMERA (R4501.1)
eMMC_CLK: eMMC (C4005.1 U4000.M6), RK3562-VCCIO2-VCCIO3 (R1429.2 TP1402.1)
eMMC_CMD: eMMC (R4001.2 U4000.M5), RK3562-VCCIO2-VCCIO3 (U1000.M26)
eMMC_D0: eMMC (R4000.2 U4000.A3), RK3562-VCCIO2-VCCIO3 (U1000.J25)
eMMC_D1: eMMC (U4000.A4), RK3562-VCCIO2-VCCIO3 (U1000.J26)
eMMC_D2: eMMC (U4000.A5), RK3562-VCCIO2-VCCIO3 (U1000.H25)
eMMC_D3: eMMC (U4000.B2), RK3562-VCCIO2-VCCIO3 (U1000.K27)
eMMC_D4: eMMC (U4000.B3), RK3562-VCCIO2-VCCIO3 (U1000.K26)
eMMC_D5: eMMC (U4000.B4), RK3562-VCCIO2-VCCIO3 (U1000.K25)
eMMC_D6: eMMC (U4000.B5), RK3562-VCCIO2-VCCIO3 (U1000.H26)
eMMC_D7: eMMC (U4000.B6), RK3562-VCCIO2-VCCIO3 (U1000.H27)
eMMC_DATA_STROBE: eMMC (R4003.1), RK3562-VCCIO2-VCCIO3 (U1000.L26)
HOST_WAKE_BT_H: RK3562-PMUIO-OSC-PLL (U1000.AE19), WF-BT-AP6256 (U6100.6)
I2C0_SCL_PMIC: RK3562-PMUIO-OSC-PLL (U1000.AG23), RK-POWER-SUPPLY (U2100.1)
I2C0_SDA_PMIC: RK3562-PMUIO-OSC-PLL (U1000.AE23), RK-POWER-SUPPLY (U2100.2)
I2C4_SCL_M0: RK3562-VCCIO5 (R1607.2 U1000.G3), MIPI-CAMERA (J4500.20)
I2C4_SDA_M0: RK3562-VCCIO5 (R1608.2 U1000.G2), MIPI-CAMERA (J4500.21)
I2S0_LRCK_M0_PMIC: RK3562-VCCIO1 (U1000.L1), RK-POWER-SUPPLY (U2100.14)
I2S0_MCLK_M0_PMIC: RK3562-VCCIO1 (U1000.K2), RK-POWER-SUPPLY (U2100.16)
I2S0_SCLK_M0_PMIC: RK3562-VCCIO1 (U1000.L3), RK-POWER-SUPPLY (U2100.15)
I2S0_SDI0_M0/PDM_SDI0_M0_PMIC: RK3562-VCCIO1 (U1000.J2), RK-POWER-SUPPLY (U2100.18)
I2S0_SDO0_M0_PMIC: RK3562-VCCIO1 (U1000.K3), RK-POWER-SUPPLY (U2100.17)
I2S2_LRCK_M0: RK3562-VCCIO4 (U1000.V27), WF-BT-AP6256 (U6100.28)
I2S2_SCLK_M0: RK3562-VCCIO4 (U1000.W26), WF-BT-AP6256 (U6100.26)
I2S2_SDI_M0: RK3562-VCCIO4 (U1000.1J15), WF-BT-AP6256 (U6100.25)
I2S2_SDO_M0: RK3562-VCCIO4 (U1000.1H15), WF-BT-AP6256 (U6100.27)
IMU-CS: RK3562-VCCIO6 (U1000.M3), STM32G070RBT6 (U17.60), IMU-ICM-4267-P  (R18.2 U19.12)
IMU-FSYNC: RK3562-VCCIO6 (U1000.N1), STM32G070RBT6 (U17.54), IMU-ICM-4267-P  (U19.7)
IMU-INT1: RK3562-VCCIO6 (U1000.N2), STM32G070RBT6 (U17.53), IMU-ICM-4267-P  (R93.2 U19.4)
IMU-INT2: RK3562-VCCIO6 (U1000.P3), STM32G070RBT6 (U17.52), IMU-ICM-4267-P  (R92.2 U19.9)
IMU-MISO: RK3562-VCCIO6 (U1000.R2), STM32G070RBT6 (U17.58), IMU-ICM-4267-P  (U19.1)
IMU-MOSI: RK3562-VCCIO6 (U1000.T3), STM32G070RBT6 (U17.59), IMU-ICM-4267-P  (U19.14)
IMU-SCLK: RK3562-VCCIO6 (U1000.N3), STM32G070RBT6 (U17.57), IMU-ICM-4267-P  (U19.13)
LiDAR-M-CTRL: LiDAR  (Q20.1 R116.2), STM32G070RBT6 (U17.15)
LiDAR-TXD: RK3562-VCCIO6 (U1000.R3), STM32G070RBT6 (J23.2)
MIC1_IN: RK-POWER-SUPPLY (C2151.1), SPEAKER-MIC (C17.1 ED1.1 MIC1.1 R21.2)
MIC2_IN: RK-POWER-SUPPLY (C2153.1), SPEAKER-MIC (C17.2 ED2.1 MIC1.2 R22.1)
MIPI_CSI_RX0_CLK0_N: RK3562-VCCIO5 (U1000.AG7), MIPI-CAMERA (J4500.30)
MIPI_CSI_RX0_CLK0_P: RK3562-VCCIO5 (U1000.AF7), MIPI-CAMERA (J4500.29)
MIPI_CSI_RX0_D0_N: RK3562-VCCIO5 (U1000.AG9), MIPI-CAMERA (J4500.3)
MIPI_CSI_RX0_D0_P: RK3562-VCCIO5 (U1000.AF9), MIPI-CAMERA (J4500.2)
MIPI_CSI_RX0_D1_N: RK3562-VCCIO5 (U1000.AG8), MIPI-CAMERA (J4500.26)
MIPI_CSI_RX0_D1_P: RK3562-VCCIO5 (U1000.AF8), MIPI-CAMERA (J4500.27)
MIPI_CSI_RX0_D2_N: RK3562-VCCIO5 (U1000.AG6), MIPI-CAMERA (J4500.6)
MIPI_CSI_RX0_D2_P: RK3562-VCCIO5 (U1000.AF6), MIPI-CAMERA (J4500.5)
MIPI_CSI_RX0_D3_N: RK3562-VCCIO5 (U1000.AG5), MIPI-CAMERA (J4500.9)
MIPI_CSI_RX0_D3_P: RK3562-VCCIO5 (U1000.AF5), MIPI-CAMERA (J4500.8)
NetC92_1: MAIN-FAN  (C92.1 J14.4), STM32G070RBT6 (U17.19)
NetC3001_1: RK3562-DDR-PHY (U1000.1B11), DDR-LPDDR4 (C3001.1 U3000.T11)
NetD17_1: WATER-PUMP  (D17.1 R81.2), STM32G070RBT6 (U17.30)
NetD18_1: MAIN-BRUSH-MOTOR  (D18.1 R82.1), STM32G070RBT6 (U17.29)
NetD19_1: WHEEL-MOTORs  (D19.1 R108.1), STM32G070RBT6 (U17.27)
NetD20_1: WHEEL-MOTORs  (D20.1 R109.1), STM32G070RBT6 (U17.28)
NetD21_1: SIDE-BRUSH-MOTORs  (D21.1 R111.2), STM32G070RBT6 (U17.32)
NetD22_1: SIDE-BRUSH-MOTORs  (D22.1 R112.2), STM32G070RBT6 (U17.31)
NetD25_1: BMS-SYSTEM-POWER (D25.1), STM32G070RBT6 (U17.43)
NetD25_2: BMS-SYSTEM-POWER (D25.2 R45.1), BUTTON-LEDs  (K3.3 K3.4)
NetIR1_1: DOCKING IR-BUMPER-SENSOR (IR1.1 R61.1), STM32G070RBT6 (U17.34)
NetIR2_1: DOCKING IR-BUMPER-SENSOR (IR2.1 R65.1), STM32G070RBT6 (U17.35)
NetJ2_3: RK3562-USB-PCIe-PHY (U1000.AF27), BMS-SYSTEM-POWER (J2.3)
NetJ2_4: RK3562-USB-PCIe-PHY (U1000.AF26), BMS-SYSTEM-POWER (J2.4)
NetJ3_2: CONTROLLER-RK3562 (J3.2), RK3562-PMUIO-OSC-PLL (U1000.AF20)
NetJ3_3: CONTROLLER-RK3562 (J3.3), RK3562-PMUIO-OSC-PLL (U1000.AE20)
NetJ4_4: ANTI-FALL-IR-SENSORs (J4.4 R69.2), STM32G070RBT6 (U17.20)
NetJ4_8: ANTI-FALL-IR-SENSORs (J4.8 R73.2), STM32G070RBT6 (U17.21)
NetJ5_4: ANTI-FALL-IR-SENSORs (J5.4 R70.2), STM32G070RBT6 (U17.22)
NetJ5_8: ANTI-FALL-IR-SENSORs (J5.8 R74.2), STM32G070RBT6 (U17.23)
NetJ8_1: SIDE-PROXIMITY-IR-SENSOR  (J8.1 R75.1), STM32G070RBT6 (U17.55)
NetJ9_1: SIDE-PROXIMITY-IR-SENSOR  (J9.1 R78.1), STM32G070RBT6 (U17.40)
NetK2_3: BUTTON-LEDs  (K2.3 K2.4 R120.1), STM32G070RBT6 (U17.64)
NetQ10_1: MAIN-BRUSH-MOTOR  (Q10.1 R85.1), STM32G070RBT6 (U17.14)
NetQ16_1: SIDE-BRUSH-MOTORs  (Q16.1 R107.2), STM32G070RBT6 (U17.38)
NetQ18_1: SIDE-BRUSH-MOTORs  (Q18.1 R110.2), STM32G070RBT6 (U17.39)
NetR5_1: BMS-SYSTEM-POWER (R5.1 R6.1 U2.1), STM32G070RBT6 (U17.2)
NetR9_1: BMS-SYSTEM-POWER (R9.1 R12.2), STM32G070RBT6 (U17.1)
NetR27_2: WATER-PUMP  (R27.2), STM32G070RBT6 (U17.13)
NetR28_2: BMS-SYSTEM-POWER (R28.2), STM32G070RBT6 (U17.47)
NetR30_2: BMS-SYSTEM-POWER (R30.2 R33.2), STM32G070RBT6 (U17.18)
NetR77_1: SIDE-PROXIMITY-IR-SENSOR  (R77.1), STM32G070RBT6 (U17.56)
NetR80_1: SIDE-PROXIMITY-IR-SENSOR  (R80.1), STM32G070RBT6 (U17.41)
NetR89_1: WHEEL-MOTORs  (R89.1), STM32G070RBT6 (U17.63)
NetR90_1: WHEEL-MOTORs  (R90.1), STM32G070RBT6 (U17.61)
NetR91_2: WHEEL-MOTORs  (R91.2), STM32G070RBT6 (U17.62)
NetR95_1: WHEEL-MOTORs  (R95.1), STM32G070RBT6 (U17.42)
NetR97_1: WHEEL-MOTORs  (R97.1), STM32G070RBT6 (U17.24)
NetR98_1: WHEEL-MOTORs  (R98.1), STM32G070RBT6 (U17.36)
NetR102_1: WHEEL-MOTORs  (R102.1), STM32G070RBT6 (U17.37)
NetR104_1: MAIN-FAN  (R104.1), STM32G070RBT6 (U17.50)
NetR105_2: MAIN-FAN  (R105.2), STM32G070RBT6 (U17.51)
NetR123_2: BUTTON-LEDs  (R123.2), STM32G070RBT6 (U17.49)
NetR126_2: BUTTON-LEDs  (R126.2), STM32G070RBT6 (U17.48)
NetU6_1: BMS-SYSTEM-POWER (U6.1), STM32G070RBT6 (U17.17)
NetU1000_1A1: RK3562-DDR-PHY (U1000.1A1), DDR-LPDDR4 (U3000.D10)
NetU1000_1A3: RK3562-DDR-PHY (U1000.1A3), DDR-LPDDR4 (U3000.D3)
NetU1000_1A6: RK3562-DDR-PHY (U1000.1A6), DDR-LPDDR4 (U3000.H10)
NetU1000_1A7: RK3562-DDR-PHY (U1000.1A7), DDR-LPDDR4 (U3000.J11)
NetU1000_1A8: RK3562-DDR-PHY (U1000.1A8), DDR-LPDDR4 (U3000.P11)
NetU1000_1A9: RK3562-DDR-PHY (U1000.1A9), DDR-LPDDR4 (U3000.R11)
NetU1000_1A10: RK3562-DDR-PHY (U1000.1A10), DDR-LPDDR4 (U3000.R10)
NetU1000_1A13: RK3562-DDR-PHY (U1000.1A13), DDR-LPDDR4 (U3000.W3)
NetU1000_1A15: RK3562-DDR-PHY (U1000.1A15), DDR-LPDDR4 (U3000.W10)
NetU1000_1B1: RK3562-DDR-PHY (U1000.1B1), DDR-LPDDR4 (U3000.E10)
NetU1000_1B3: RK3562-DDR-PHY (U1000.1B3), DDR-LPDDR4 (U3000.E3)
NetU1000_1B8: RK3562-DDR-PHY (U1000.1B8), DDR-LPDDR4 (U3000.H11)
NetU1000_1B13: RK3562-DDR-PHY (U1000.1B13), DDR-LPDDR4 (U3000.V3)
NetU1000_1B15: RK3562-DDR-PHY (U1000.1B15), DDR-LPDDR4 (U3000.V10)
NetU1000_A2: RK3562-DDR-PHY (U1000.A2), DDR-LPDDR4 (U3000.C10)
NetU1000_A3: RK3562-DDR-PHY (U1000.A3), DDR-LPDDR4 (U3000.C9)
NetU1000_A4: RK3562-DDR-PHY (U1000.A4), DDR-LPDDR4 (U3000.F9)
NetU1000_A6: RK3562-DDR-PHY (U1000.A6), DDR-LPDDR4 (U3000.C4)
NetU1000_A8: RK3562-DDR-PHY (U1000.A8), DDR-LPDDR4 (U3000.E2)
NetU1000_A10: RK3562-DDR-PHY (U1000.A10), DDR-LPDDR4 (U3000.J2)
NetU1000_A13: RK3562-DDR-PHY (U1000.A13), DDR-LPDDR4 (U3000.J9)
NetU1000_A15: RK3562-DDR-PHY (U1000.A15), DDR-LPDDR4 (U3000.P9)
NetU1000_A18: RK3562-DDR-PHY (U1000.A18), DDR-LPDDR4 (U3000.P2)
NetU1000_A20: RK3562-DDR-PHY (U1000.A20), DDR-LPDDR4 (U3000.V2)
NetU1000_A22: RK3562-DDR-PHY (U1000.A22), DDR-LPDDR4 (U3000.AA4)
NetU1000_A24: RK3562-DDR-PHY (U1000.A24), DDR-LPDDR4 (U3000.U9)
NetU1000_A25: RK3562-DDR-PHY (U1000.A25), DDR-LPDDR4 (U3000.Y9)
NetU1000_A26: RK3562-DDR-PHY (U1000.A26), DDR-LPDDR4 (U3000.Y10)
NetU1000_B1: RK3562-DDR-PHY (U1000.B1), DDR-LPDDR4 (U3000.E11)
NetU1000_B2: RK3562-DDR-PHY (U1000.B2), DDR-LPDDR4 (U3000.F11)
NetU1000_B3: RK3562-DDR-PHY (U1000.B3), DDR-LPDDR4 (U3000.B9)
NetU1000_B4: RK3562-DDR-PHY (U1000.B4), DDR-LPDDR4 (U3000.E9)
NetU1000_B5: RK3562-DDR-PHY (U1000.B5), DDR-LPDDR4 (U3000.E4)
NetU1000_B6: RK3562-DDR-PHY (U1000.B6), DDR-LPDDR4 (U3000.B2)
NetU1000_B7: RK3562-DDR-PHY (U1000.B7), DDR-LPDDR4 (U3000.C3)
NetU1000_B8: RK3562-DDR-PHY (U1000.B8), DDR-LPDDR4 (U3000.C2)
NetU1000_B10: RK3562-DDR-PHY (U1000.B10), DDR-LPDDR4 (U3000.H2)
NetU1000_B11: RK3562-DDR-PHY (U1000.B11), DDR-LPDDR4 (U3000.H4)
NetU1000_B12: RK3562-DDR-PHY (U1000.B12), DDR-LPDDR4 (U3000.J5)
NetU1000_B13: RK3562-DDR-PHY (U1000.B13), DDR-LPDDR4 (U3000.J8)
NetU1000_B15: RK3562-DDR-PHY (U1000.B15), DDR-LPDDR4 (U3000.P8)
NetU1000_B16: RK3562-DDR-PHY (U1000.B16), DDR-LPDDR4 (U3000.P5)
NetU1000_B17: RK3562-DDR-PHY (U1000.B17), DDR-LPDDR4 (U3000.R4)
NetU1000_B18: RK3562-DDR-PHY (U1000.B18), DDR-LPDDR4 (U3000.R2)
NetU1000_B20: RK3562-DDR-PHY (U1000.B20), DDR-LPDDR4 (U3000.Y2)
NetU1000_B21: RK3562-DDR-PHY (U1000.B21), DDR-LPDDR4 (U3000.Y3)
NetU1000_B22: RK3562-DDR-PHY (U1000.B22), DDR-LPDDR4 (U3000.AA2)
NetU1000_B23: RK3562-DDR-PHY (U1000.B23), DDR-LPDDR4 (U3000.V4)
NetU1000_B24: RK3562-DDR-PHY (U1000.B24), DDR-LPDDR4 (U3000.V9)
NetU1000_B25: RK3562-DDR-PHY (U1000.B25), DDR-LPDDR4 (U3000.AA9)
NetU1000_B26: RK3562-DDR-PHY (U1000.B26), DDR-LPDDR4 (U3000.U11)
NetU1000_B27: RK3562-DDR-PHY (U1000.B27), DDR-LPDDR4 (U3000.V11)
NetU1000_C1: RK3562-DDR-PHY (U1000.C1), DDR-LPDDR4 (U3000.C11)
NetU1000_C2: RK3562-DDR-PHY (U1000.C2), DDR-LPDDR4 (U3000.B11)
NetU1000_C5: RK3562-DDR-PHY (U1000.C5), DDR-LPDDR4 (U3000.F4)
NetU1000_C6: RK3562-DDR-PHY (U1000.C6), DDR-LPDDR4 (U3000.B4)
NetU1000_C8: RK3562-DDR-PHY (U1000.C8), DDR-LPDDR4 (U3000.F2)
NetU1000_C10: RK3562-DDR-PHY (U1000.C10), DDR-LPDDR4 (U3000.H9)
NetU1000_C11: RK3562-DDR-PHY (U1000.C11), DDR-LPDDR4 (U3000.H3)
NetU1000_C12: RK3562-DDR-PHY (U1000.C12), DDR-LPDDR4 (U3000.J4)
NetU1000_C16: RK3562-DDR-PHY (U1000.C16), DDR-LPDDR4 (U3000.P4)
NetU1000_C17: RK3562-DDR-PHY (U1000.C17), DDR-LPDDR4 (U3000.R3)
NetU1000_C18: RK3562-DDR-PHY (U1000.C18), DDR-LPDDR4 (U3000.R9)
NetU1000_C20: RK3562-DDR-PHY (U1000.C20), DDR-LPDDR4 (U3000.U2)
NetU1000_C22: RK3562-DDR-PHY (U1000.C22), DDR-LPDDR4 (U3000.Y4)
NetU1000_C23: RK3562-DDR-PHY (U1000.C23), DDR-LPDDR4 (U3000.U4)
NetU1000_C26: RK3562-DDR-PHY (U1000.C26), DDR-LPDDR4 (U3000.AA11)
NetU1000_C27: RK3562-DDR-PHY (U1000.C27), DDR-LPDDR4 (U3000.Y11)
PC3: DOCKING IR-BUMPER-SENSOR (P-SW1.3 R62.1), STM32G070RBT6 (U17.16)
PC13: DOCKING IR-BUMPER-SENSOR (P-SW2.3 R64.1), STM32G070RBT6 (U17.3)
PDM_CLK0_M0_PMIC: RK3562-VCCIO1 (U1000.J1), RK-POWER-SUPPLY (U2100.19)
PMIC_32KOUT_WIFI: RK-POWER-SUPPLY (R2110.2 U2100.68), WF-BT-AP6256 (R6114.1)
PMIC_EXT_EN: RK-POWER-SUPPLY (U2100.60), BMS-SYSTEM-POWER (R16.1)
PMIC_INT_L: RK3562-PMUIO-OSC-PLL (U1000.AF22), RK-POWER-SUPPLY (U2100.7)
PMIC_PWRON: RK-POWER-SUPPLY (C2154.1 U2100.52), STM32G070RBT6 (U17.44)
PMIC_SLEEP_H: RK3562-PMUIO-OSC-PLL (U1000.AF23), RK-POWER-SUPPLY (U2100.49)
PWM_NPU: RK3562-PMUIO-OSC-PLL (U1000.1R11), RK-PERIPHERAL-POWER (R2209.2 R2210.1 R2214.2 R2215.1)
RESETn: RK3562-PMUIO-OSC-PLL (C1200.1 R1202.2 R1203.2 U1000.1P12), RK-POWER-SUPPLY (C2155.1 R2112.2 U2100.67), STM32G070RBT6 (U17.33)
SD_TF-DET-L: RK3562-PMUIO-OSC-PLL (U1000.1R15), SD_TF-CARD (R4205.1)
SDIO_CLK: RK3562-VCCIO4 (R1525.2), WF-BT-AP6256 (U6100.17)
SDIO_CMD: RK3562-VCCIO4 (U1000.T27), WF-BT-AP6256 (R6111.2 R6112.1)
SDIO_D0: RK3562-VCCIO4 (U1000.U26), WF-BT-AP6256 (R6106.2 R6107.1)
SDIO_D1: RK3562-VCCIO4 (U1000.V25), WF-BT-AP6256 (R6108.1)
SDIO_D2: RK3562-VCCIO4 (U1000.T25), WF-BT-AP6256 (R6109.1)
SDIO_D3: RK3562-VCCIO4 (U1000.T26), WF-BT-AP6256 (R6110.1)
SDMMC0_CLK: RK3562-VCCIO2-VCCIO3 (R1436.2), SD_TF-CARD (D4203.1 J4200.5)
SDMMC0_CMD: RK3562-VCCIO2-VCCIO3 (R1448.2 U1000.P25), SD_TF-CARD (R4200.1)
SDMMC0_D0: RK3562-VCCIO2-VCCIO3 (R1447.2 U1000.R25), SD_TF-CARD (R4203.1)
SDMMC0_D1: RK3562-VCCIO2-VCCIO3 (U1000.R26), SD_TF-CARD (R4204.1)
SDMMC0_D2: RK3562-VCCIO2-VCCIO3 (U1000.N25), SD_TF-CARD (R4201.1)
SDMMC0_D3: RK3562-VCCIO2-VCCIO3 (U1000.N26), SD_TF-CARD (R4202.1)
SPKN_OUT: RK-POWER-SUPPLY (C2145.1 FB2101.2), SPEAKER-MIC (ED3.1 J18#2.1)
SPKP_OUT: RK-POWER-SUPPLY (C2150.1 FB2102.2), SPEAKER-MIC (ED4.1 J18#2.2)
STM32-RST: RK3562-VCCIO6 (U1000.AA1), STM32G070RBT6 (C18.1 J21.3 R134.2 U17.12)
UART1_CTSn_M0: RK3562-VCCIO4 (U1000.Y27), WF-BT-AP6256 (U6100.41)
UART1_RTSn_M0: RK3562-VCCIO4 (U1000.AA25), WF-BT-AP6256 (U6100.44)
UART1_RX_M0: RK3562-VCCIO4 (U1000.Y26), WF-BT-AP6256 (U6100.42)
UART1_TX_M0: RK3562-VCCIO4 (U1000.Y25), WF-BT-AP6256 (U6100.43)
UART4_RXD_M0: RK3562-VCCIO6 (U1000.R1), LiDAR  (R113.1 R114.2)
UART9_RXD_M0: RK3562-VCCIO6 (U1000.AC2), STM32G070RBT6 (U17.25)
UART9_TXD_M0: RK3562-VCCIO6 (U1000.AC1), STM32G070RBT6 (U17.26)
WIFI_PWREN_L: RK3562-PMUIO-OSC-PLL (U1000.AE24), WF-BT-AP6256 (R6102.2)
WIFI_REG_ON_H: RK3562-PMUIO-OSC-PLL (U1000.AE17), WF-BT-AP6256 (R6104.2 U6100.12)
WIFI_WAKE_HOST_H: RK3562-PMUIO-OSC-PLL (U1000.AF18), WF-BT-AP6256 (U6100.13)